# EAGLE schematic cloud_humidity_sensor (EAGLE 6.4)
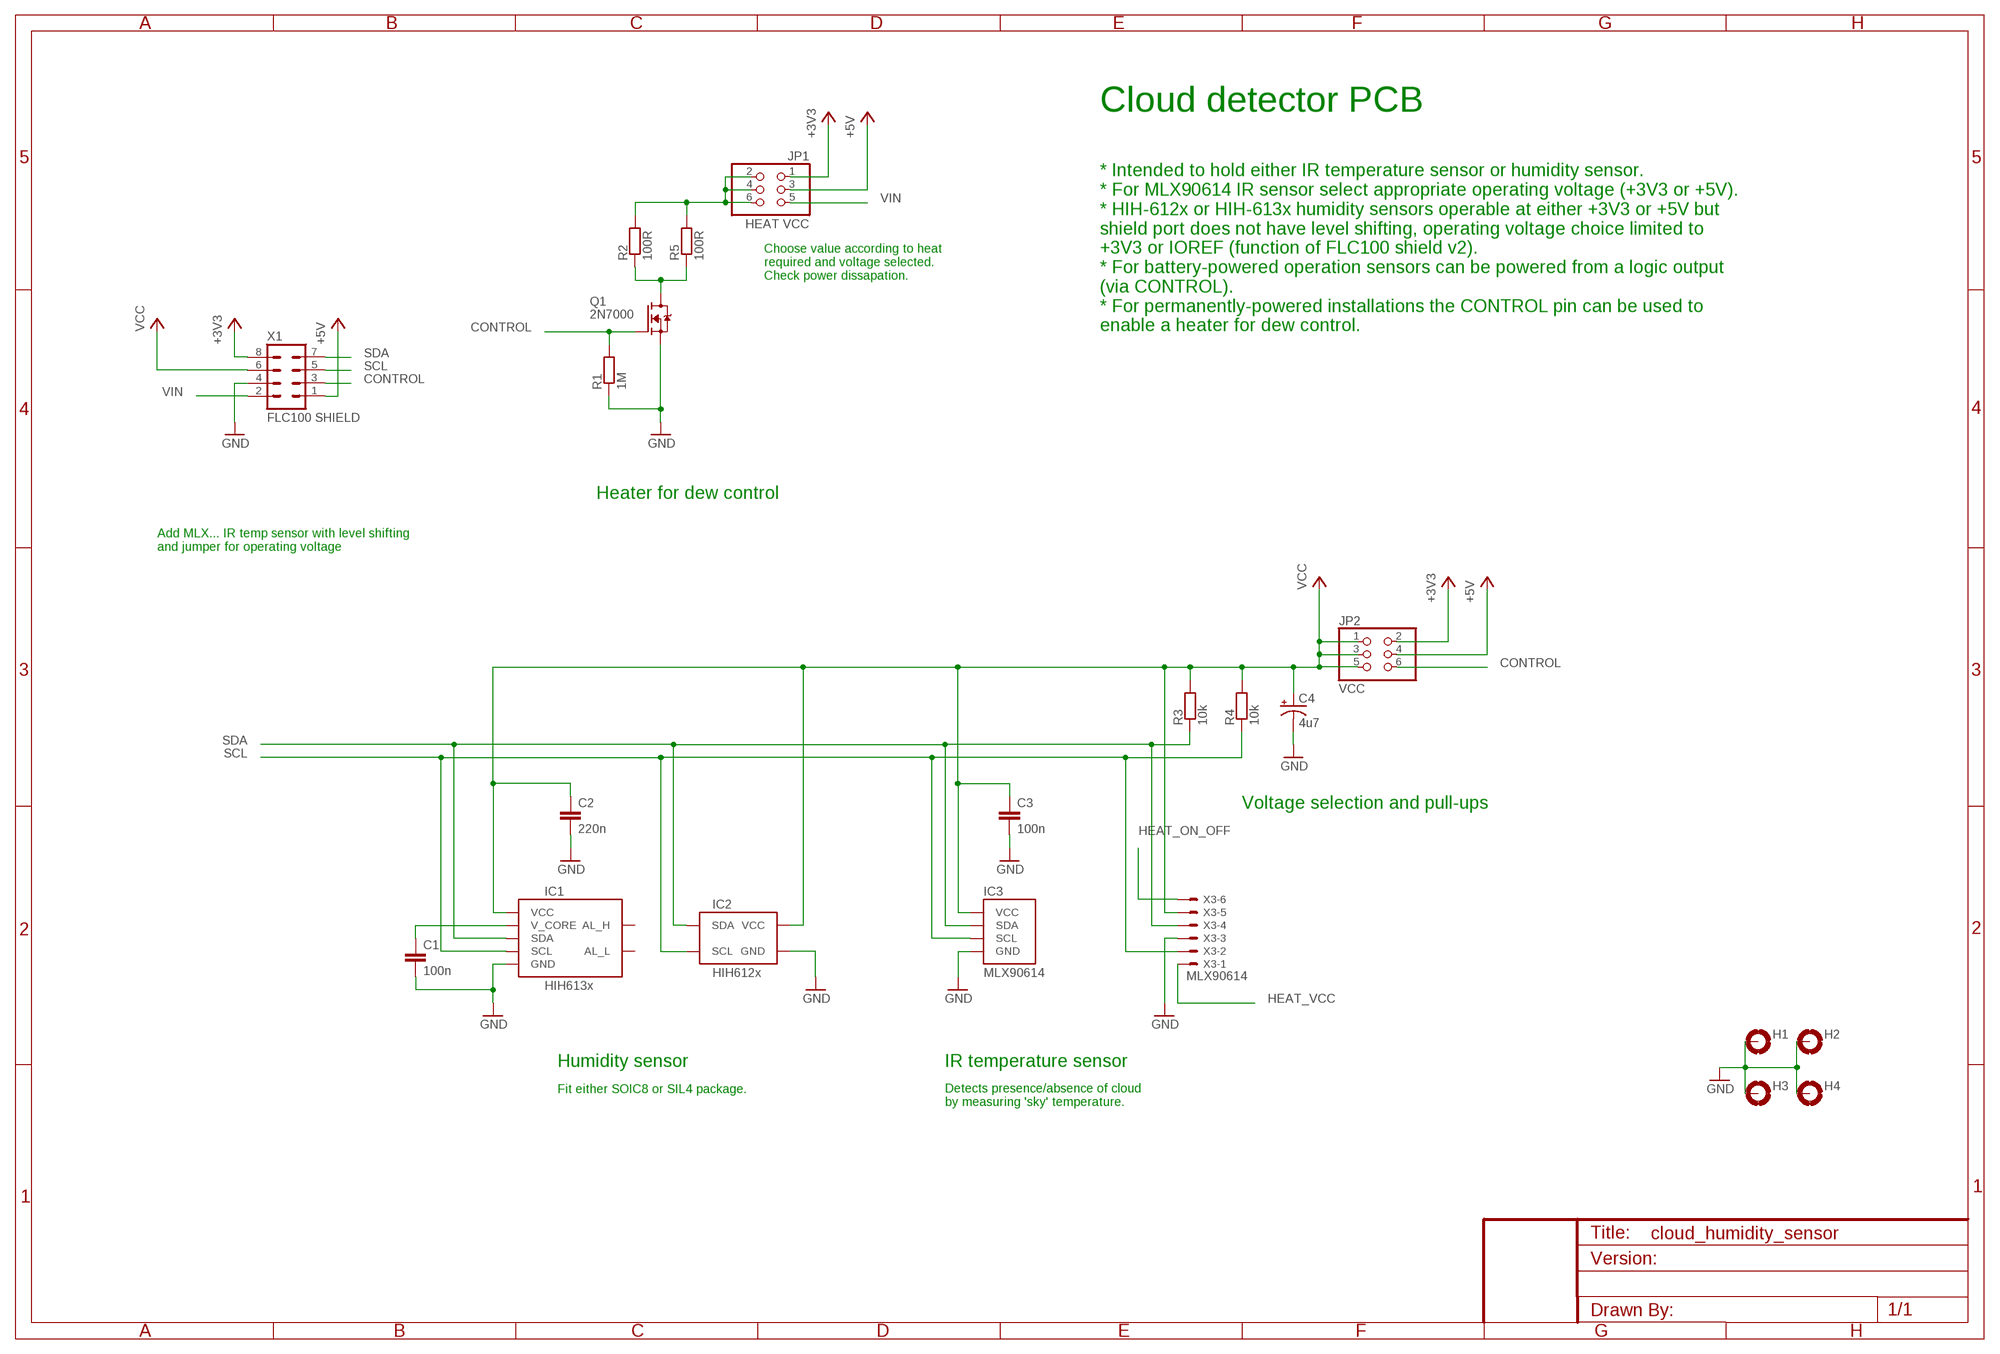
[diagram p0: schematic, sheet 1]
FRAME1 (FRAME-A3): VERSION: 1.0

## Parts
C1  100n  CAPPTH  [CAP-PTH-SMALL]
C2  220n  CAPPTH  [CAP-PTH-SMALL]
C3  100n  CAPPTH  [CAP-PTH-SMALL]
C4  4u7  CAP_POLPTH2  [CPOL-RADIAL-10UF-25V]
H1  MOUNT-PAD-ROUND3.0  [3,0-PAD]
H2  MOUNT-PAD-ROUND3.0  [3,0-PAD]
H3  MOUNT-PAD-ROUND3.0  [3,0-PAD]
H4  MOUNT-PAD-ROUND3.0  [3,0-PAD]
IC1  HIH613x  HONEYWELL-HIH613XSOIC8  [SO08]
IC2  HIH612x  HONEYWELL-HIH612X  [SIL04]
IC3  MLX90614  MLX90614TO-39  [TO39-4]
JP1  HEAT VCC  PINHD-2X3  [2X03]
JP2  VCC  PINHD-2X3  [2X03]
Q1  2N7000  [TO-92]
R1  1M  RESISTOR  [RES-AXIAL-0.4]
R2  100R  RESISTOR  [RES-AXIAL-0.4]
R3  10k  RESISTOR  [RES-AXIAL-0.4]
R4  10k  RESISTOR  [RES-AXIAL-0.4]
R5  100R  RESISTOR  [RES-AXIAL-0.4]
X1  FLC100 SHIELD  ML8  [ML8]
X3  MLX90614  22-23-2061  [22-23-2061]

## Nets
+3V3 [power]: JP1.1 JP2.2 X1.8
+5V [power]: JP1.3 JP2.4 X1.1
CONTROL: JP2.6 Q1.2(G) R1.P$2 X1.3
GND [power]: C1.2 C2.2 C3.2 C4.2(-) H1.B3,0(MOUNT) H2.B3,0(MOUNT) H3.B3,0(MOUNT) H4.B3,0(MOUNT) IC1.2(GND) IC2.2(GND) IC3.4(GND) Q1.1(S) R1.P$1 X1.4 X3.3
HEAT_ON_OFF [power]: Q1.3(D) R2.P$1 R5.P$1 X3.6
HEAT_VCC [power]: JP1.2 JP1.4 JP1.6 R2.P$2 R5.P$2 X3.1
N$4: C1.1 IC1.1(V_CORE)
SCL: IC1.3(SCL) IC2.3(SCL) IC3.1(SCL) R4.P$1 X1.5 X3.2
SDA: IC1.4(SDA) IC2.4(SDA) IC3.2(SDA) R3.P$1 X1.7 X3.4
VCC [power]: C2.1 C3.1 C4.1(+) IC1.8(VCC) IC2.1(VCC) IC3.3(VCC) JP2.1 JP2.3 JP2.5 R3.P$2 R4.P$2 X1.6 X3.5
VIN [power]: JP1.5 X1.2
Unconnected: IC1.5(AL_H) IC1.6(AL_L)

## Notes on the sheet
- Cloud detector PCB
- * Intended to hold either IR temperature sensor or humidity sensor.
  * For MLX90614 IR sensor select appropriate operating voltage (+3V3 or +5V).
  * HIH-612x or HIH-613x humidity sensors operable at either +3V3 or +5V but
  shield port does not have level shifting, operating voltage choice limited to
  +3V3 or IOREF (function of FLC100 shield v2).
  * For battery-powered operation sensors can be powered from a logic output
  (via CONTROL).
  * For permanently-powered installations the CONTROL pin can be used to
  enable a heater for dew control.
- Choose value according to heat
  required and voltage selected.
  Check power dissapation.
- Heater for dew control
- Add MLX... IR temp sensor with level shifting
  and jumper for operating voltage
- Voltage selection and pull-ups
- Humidity sensor | IR temperature sensor
- Fit either SOIC8 or SIL4 package.
- Detects presence/absence of cloud
  by measuring 'sky' temperature.

## Library data of the parts
C1-C3 = SparkFun:CAP: Capacitor Standard 0603 ceramic capacitor, and 0.1" leaded capacitor.
C4 = SteveMarple:CAP_POL: Capacitor Polarized These are standard SMD and PTH capacitors. Normally 10uF, 47uF, and 100uF in electrolytic and tantalum varieties. Always verify the external diameter of the through hole cap, it varies with capacity, voltage, and manufacturer. The EIA devices should be standard.
H1-H4 = holes:MOUNT-PAD-ROUND: MOUNTING PAD, round
IC1 = SteveMarple:HONEYWELL-HIH613X
IC2 = SteveMarple:HONEYWELL-HIH612X
IC3 = SteveMarple:MLX90614
JP1 JP2 = pinhead:PINHD-2X3: PIN HEADER
Q1 = SteveMarple:2N7000: 2N7000 FET
R1-R5 = SteveMarple:RESISTOR: 1/4W PTH resistor
X1 = SteveMarple:ML8
X3 = con-molex:22-23-2061: .100" (2.54mm) Center Header - 6 Pin; MF: MOLEX; MPN: 22-23-2061; OC_FARNELL: 1462922; OC_NEWARK: 27C1933

## Net classes
1 power: width 0.381 mm